# Altium schematic sheet Sheet1.SchDoc: Arduino UNO REV3 Compatible
size A4; ApprovedBy: Leonardo Starling; DrawnBy: Leonardo Starling; Engineer: Leonardo Starling; Organization: STARLING Electronics; Address2: Belo Horizonte, MG; Address3: Brasil; DocumentNumber: 00.00.01; Revision: 00; SheetNumber: 2; SheetTotal: 3
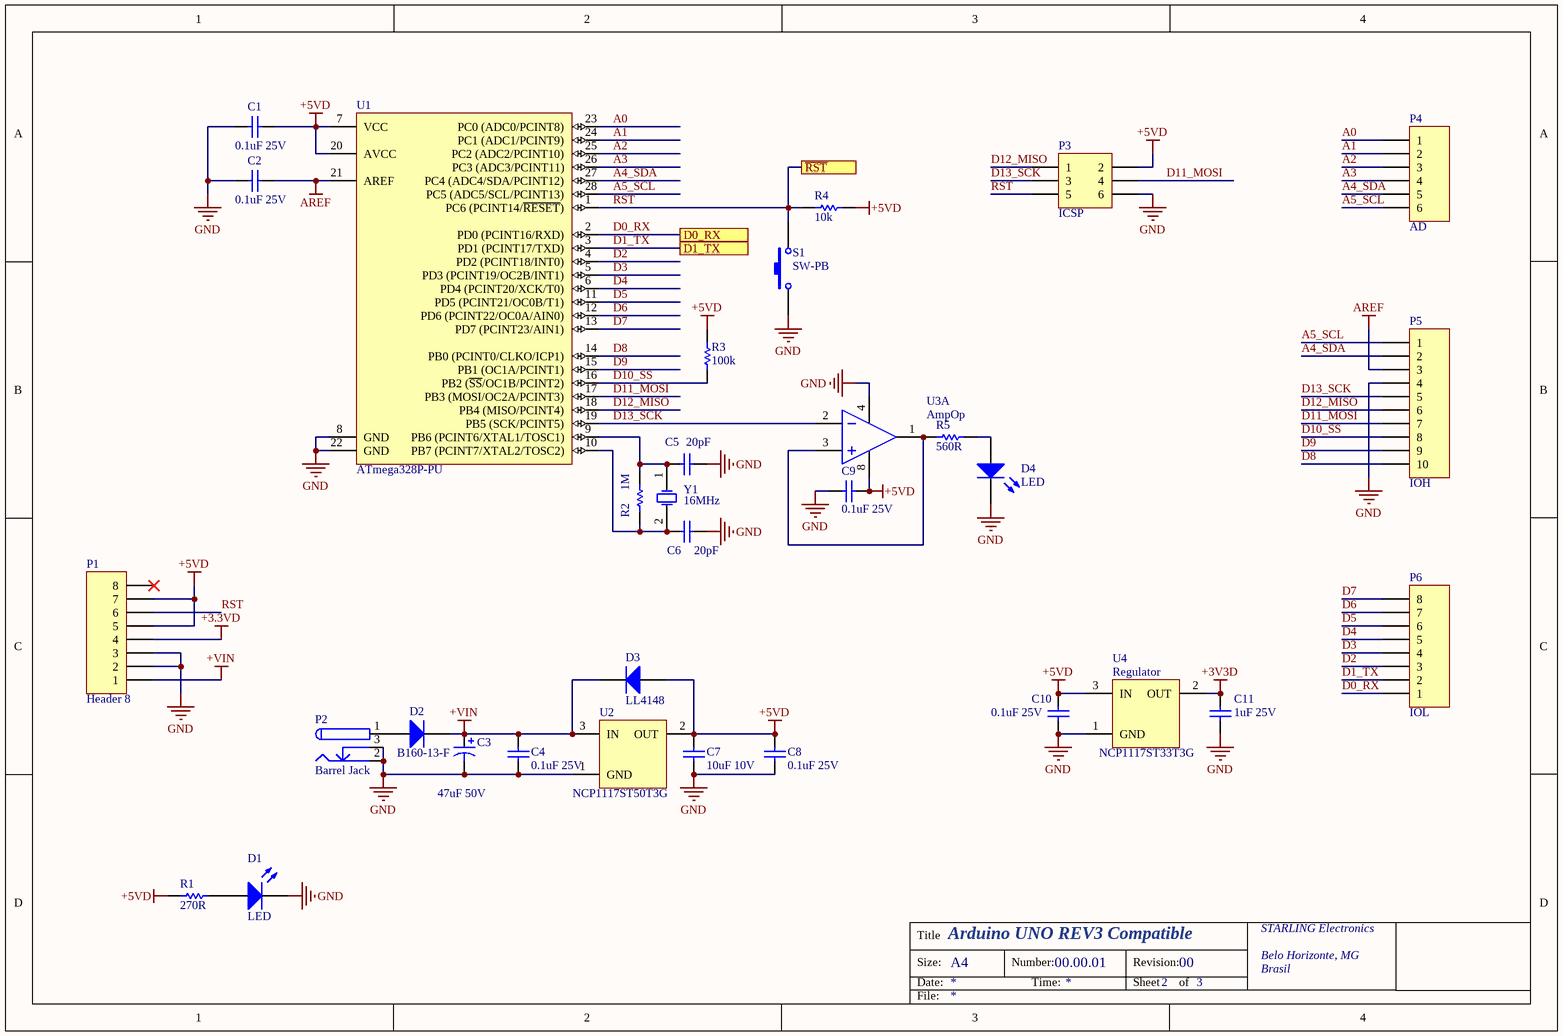
[diagram p0: Sheet1.SchDoc]

## Parts
C1  0.1uF 25V  [C1608[0603]]
C2  0.1uF 25V  [C1608[0603]]
C3  47uF 50V  [Cap_Al_SMD_C6_6.6x6.6mm]
C4  0.1uF 25V  [C1608[0603]]
C5  20pF  [C1608[0603]]
C6  20pF  [C1608[0603]]
C7  10uF 10V  [C2012[0805]]
C8  0.1uF 25V  [C1608[0603]]
C9  0.1uF 25V  [C1608[0603]]
C10  0.1uF 25V  [C1608[0603]]
C11  1uF 25V  [C2012[0805]]
D1  LED  [LED-0603-G]
D2  B160-13-F  [DO214AC]
D3  LL4148  [SOD-80/MLL34]
D4  LED  [LED-0603-R]
P1  Header 8  [HDR1X8F]
P2  Barrel Jack  [BARREL2.5]
P3  ICSP  [HDR2X3M]
P4  AD  [HDR1X6m]
P5  IOH  [HDR1X10]
P6  IOL  [HDR1X8F]
R1  270R  [R1608[0603]]
R2  1M  [R2012[0805]]
R3  100k  [R1608[0603]]
R4  10k  [R1608[0603]]
R5  560R  [R1608[0603]]
S1  SW-PB  [PB-SW-SMT]
U1  ATmega328P-PU  [DIP28]
U2  NCP1117ST50T3G  [SOT223_N]
U3  AmpOp  [TSSOP-8]  (part A of 2)
U4  Regulator  Manufacturer Part Number: NCP1117ST33T3G  [SOT223_N]
Y1  16MHz  [CRYSTAL-HC49/4H_SMX]

## Ports
D0_RX, D1_TX, ~{RST}

## Nets
+3.3VD: P1.4
+3V3D: C11.2 U4.2(OUT)
+5VD: C1.1 C7.2 C8.2 C9.1 C10.2 D3.1(A) P1.5 P1.7 P3.2 R1.1 R3.1 R4.1 U1.7(VCC) U1.20(AVCC) U2.2(OUT) U3.8(V-) U4.3(IN)
+VIN: C3.1 C4.2 D2.2(K) D3.2(K) P1.1 U2.3(IN)
AREF: C2.1 P5.3 U1.21(AREF)
GND: C1.2 C2.2 C3.2 C4.1 C5.2 C6.2 C7.1 C8.1 C9.2 C10.1 C11.1 D1.2(K) D4.2(K) P1.2 P1.3 P2.2 P2.3 P3.6 P5.4 S1.1 U1.8(GND) U1.22(GND) U2.1(GND) U3.4(V+) U4.1(GND)
A0: P4.1 U1.23(PC0_(ADC0/PCINT8))
A1: P4.2 U1.24(PC1_(ADC1/PCINT9))
A2: P4.3 U1.25(PC2_(ADC2/PCINT10))
A3: P4.4 U1.26(PC3_(ADC3/PCINT11))
A4_SDA: P4.5 P5.2 U1.27(PC4_(ADC4/SDA/PCINT12))
A5_SCL: P4.6 P5.1 U1.28(PC5_(ADC5/SCL/PCINT13))
D0_RX: P6.1 U1.2(PD0_(PCINT16/RXD)) ; port D0_RX
D1_TX: P6.2 U1.3(PD1_(PCINT17/TXD)) ; port D1_TX
D2: P6.3 U1.4(PD2_(PCINT18/INT0))
D3: P6.4 U1.5(PD3_(PCINT19/OC2B/INT1))
D4: P6.5 U1.6(PD4_(PCINT20/XCK/T0))
D5: P6.6 U1.11(PD5_(PCINT21/OC0B/T1))
D6: P6.7 U1.12(PD6_(PCINT22/OC0A/AIN0))
D7: P6.8 U1.13(PD7_(PCINT23/AIN1))
D8: P5.10 U1.14(PB0_(PCINT0/CLKO/ICP1))
D9: P5.9 U1.15(PB1_(OC1A/PCINT1))
D10_SS: P5.8 R3.2 U1.16(PB2_(~{SS}/OC1B/PCINT2))
D11_MOSI: P3.4 P5.7 U1.17(PB3_(MOSI/OC2A/PCINT3))
D12_MISO: P3.1 P5.6 U1.18(PB4_(MISO/PCINT4))
D13_SCK: P3.3 P5.5 U1.19(PB5_(SCK/PCINT5)) U3.2(IN-)
~{RST}: P3.5 R4.2 S1.2 U1.1(PC6_(PCINT14/~{RESET})) ; port ~{RST}
RST: P1.6
NetC5_1: C5.1 R2.2 U1.9(PB6_(PCINT6/XTAL1/TOSC1)) Y1.1(OSC1)
NetC6_1: C6.1 R2.1 U1.10(PB7_(PCINT7/XTAL2/TOSC2)) Y1.2(OSC2)
NetD1_1: D1.1(A) R1.2
NetD2_1: D2.1(A) P2.1
NetD4_1: D4.1(A) R5.2
NetR5_1: R5.1 U3.1(OUT) U3.3(IN+)

Not connected (* = marked no-connect by the designer): P1 8*

## Notes on the sheet
- Title
- Size:
- Date:
- A4
- Number:
- Time:
- Revision:
- Sheet
- of
- File:

## Library data of the parts
C1 C2 C9 C10 = C: Capacitor; Manufacturer Part Number: GCM188R71E104KA57D; Value: 1; Capacitance: 100nF; Tolerance: 10%; Dielectric: X7R; Manufacturer: *; PartNumber: *; Package Type: *; Supplier 1: Digi-Key; Supplier Part Number 1: GCM188R71E104KA57D-ND; Stock 1: 0; Mount: Surface Mount; Case/Package: 0603; Case Code (Imperial): 0603; Case Code (Metric): 1608; Min Operating Temperature: -55°C; Max Operating Temperature: 125°C; Packaging: Tape and Reel; Voltage Rating: 25V; Voltage Rating (DC): 25V; Package Quantity: 4000; Termination: SMD/SMT; Voltage: 25V; Length: 1.6mm; Height: 0.8mm; Width: 0.8mm; Thickness: 0.035inch; Depth: 0.8mm; Ratings: AEC-Q200; Radiation Hardening: No; Lead Free: Lead Free
C3 = CP: Polarized Capacitor; Manufacturer Part Number: EEE-1EA470WP; Tolerance: 20%; Ripple Current: 70mA; Voltage Rating: 25V; Life (Hours): 1000Hour; Manufacturer: *; PartNumber: *; Package Type: *; Value: *; Supplier 1: Mouser; Supplier Part Number 1: 667-EEE-1EA470WP; Stock 1: 16748; Pricing 1: 1=0.36, 10=0.173, 50=0.173, 100=0.149, 500=0.112, 1000=0.094, 2000=0.084, 10000=0.077, 25000=0.075, 50000=0.067 (USD); Mount: Surface Mount,PCB; Case/Package: Radial; Contact Plating: Tin; Min Operating Temperature: -40°C; Max Operating Temperature: 85°C; Capacitance: 47uF; Packaging: Tape and Reel; Voltage Rating (DC): 25V; Package Quantity: 1; Termination: SMD/SMT; Ripple Current (AC): 70mA; Diameter: 6.3mm; Length: 5.5mm; Height: 5.4mm; Height - Seated (Max): 0.213inch; Radiation Hardening: No; REACH SVHC: Unknown; Lead Free: Lead Free; ComponentLink1URL: http://www.industrial.panasonic.com/www-data/pdf/ABA0000/ABA0000CE2.pdf?src-supplier=Avnet; ComponentLink1Description: http://www.industrial.panasonic.com/www-data/pdf/ABA0000/ABA0000CE2.pdf?src-supplier=Avnet; ComponentLink2URL: http://www.jameco.com/Jameco/Products/ProdDS/1356009.pdf?src-supplier=Jameco; ComponentLink2Description: http://www.jameco.com/Jameco/Products/ProdDS/1356009.pdf?src-supplier=Jameco; ComponentLink3URL: https://industrial.panasonic.com/cdbs/www-data/pdf/RDE0000/ABA0000C1145.pdf?src-supplier=Future+Electronics; ComponentLink3Description: https://industrial.panasonic.com/cdbs/www-data/pdf/RDE0000/ABA0000C1145.pdf?src-supplier=Future+Electronics; ComponentLink4URL: https://www.alliedelec.com/m/d/310b2cfd0553a89b5ffae819c6e32d0a.pdf?src-supplier=Allied+Electronics; ComponentLink4Description: https://www.alliedelec.com/m/d/310b2cfd0553a89b5ffae819c6e32d0a.pdf?src-supplier=Allied+Electronics; ComponentLink5URL: http://www.mouser.com/ds/2/315/ABA0000CE2-40801.pdf?src-supplier=Mouser; ComponentLink5Description: http://www.mouser.com/ds/2/315/ABA0000CE2-40801.pdf?src-supplier=Mouser; ComponentLink6URL: http://www.industrial.panasonic.com/www-data/pdf/ABA0000/ABA0000CE2.pdf?src-supplier=Avnet+Asia; ComponentLink6Description: http://www.industrial.panasonic.com/www-data/pdf/ABA0000/ABA0000CE2.pdf?src-supplier=Avnet+Asia; ComponentLink7URL: http://www.industrial.panasonic.com/www-data/pdf/ABA0000/ABA0000CE2.pdf?src-supplier=Avnet+Europe; ComponentLink7Description: http://www.industrial.panasonic.com/www-data/pdf/ABA0000/ABA0000CE2.pdf?src-supplier=Avnet+Europe; ComponentLink8URL: https://www.verical.com/server-webapp/html/getDatasheet?partID=135372&src-supplier=Verical; ComponentLink8Description: https://www.verical.com/server-webapp/html/getDatasheet?partID=135372&src-supplier=Verical
C4 = C: Capacitor; Manufacturer Part Number: C0603C104Z3VACTU; Value: 1; Dielectric Material: Ceramic; Capacitance: 100nF; Tolerance: 80%; Dielectric: Y5V; Dissipation Factor: 7%; Manufacturer: *; PartNumber: *; Package Type: *; Supplier 1: Digi-Key; Supplier Part Number 1: 399-1100-6-ND; Stock 1: 1624830; Pricing 1: 1=0.1, 10=0.035, 100=0.0156, 500=0.01114, 1000=0.00875 (USD); Mount: Surface Mount,PCB; Case/Package: 0603; Number of Pins: 2; Case Code (Metric): 1608; Case Code (Imperial): 0603; Min Operating Temperature: -30°C; Max Operating Temperature: 85°C; Packaging: Tape and Reel; Voltage Rating: 25V; Voltage Rating (DC): 25V; Package Quantity: 1; Termination: SMD/SMT; Voltage: 25V; Length: 1.6mm; Height: 0.8mm; Width: 0.031inch; Thickness: 0.034inch; Depth: 0.8mm; Lead Pitch: 0.7mm; Radiation Hardening: No; REACH SVHC: No SVHC; Lead Free: Lead Free; ComponentLink1URL: http://www.farnell.com/datasheets/1470417.pdf?src-supplier=Element14; ComponentLink1Description: http://www.farnell.com/datasheets/1470417.pdf?src-supplier=Element14; ComponentLink2URL: http://www.farnell.com/datasheets/1828802.pdf?src-supplier=Element14; ComponentLink2Description: http://www.farnell.com/datasheets/1828802.pdf?src-supplier=Element14; ComponentLink3URL: http://www.alliedelec.com/m/d/9bfe7773041ffe9d406e68bc7b377fdd.pdf?src-supplier=Allied+Electronics; ComponentLink3Description: http://www.alliedelec.com/m/d/9bfe7773041ffe9d406e68bc7b377fdd.pdf?src-supplier=Allied+Electronics
C5 C6 = C: Capacitor; Manufacturer Part Number: CL10C200JB8NNNC; Value: 1; Tolerance: 5%; Dielectric: C0G; Voltage Rating: 50V; Temperature Coefficient: 300ppm/°C; Manufacturer: *; PartNumber: *; Package Type: *; Supplier 1: Digi-Key; Supplier Part Number 1: 1276-1187-6-ND; Stock 1: 40000; Pricing 1: 1=0.1, 10=0.048, 100=0.0214, 500=0.01532, 1000=0.01203 (USD); Mount: Surface Mount; Case/Package: 0603; Case Code (Metric): 1608; Case Code (Imperial): 0603; Min Operating Temperature: -55°C; Max Operating Temperature: 125°C; Capacitance: 20pF; Package Quantity: 1; Packaging: Tape and Reel; Voltage: 50V; Length: 1.6mm; Height: 0.8mm; Width: 0.031inch; Thickness: 0.035inch; Depth: 0.8mm; Radiation Hardening: No
C7 = C: Capacitor; Manufacturer Part Number: C2012X7R1A106K125AC; Value: 1; Dielectric Material: Ceramic; Tolerance: 10%; Dielectric: X7R; Manufacturer: *; PartNumber: *; Package Type: *; Supplier 1: Digi-Key; Supplier Part Number 1: 445-6857-6-ND; Stock 1: 760363; Pricing 1: 1=0.5, 10=0.345, 100=0.207, 500=0.15526, 1000=0.1311 (USD); Mount: Surface Mount; Case/Package: 0805; Number of Pins: 2; Weight: 0.000194oz; Case Code (Metric): 2012; Case Code (Imperial): 0805; Contact Plating: Tin,Matte; Min Operating Temperature: -55°C; Max Operating Temperature: 125°C; Capacitance: 10uF; Voltage Rating: 10V; Packaging: Tape and Reel; Package Quantity: 1; Voltage Rating (DC): 10V; Termination: SMD/SMT; Voltage: 10V; Composition: Ceramic; Length: 2mm; Height: 1.25mm; Width: 0.049inch; Thickness: 0.057inch; Depth: 1.25mm; Radiation Hardening: No; REACH SVHC: No SVHC; Lead Free: Lead Free; ComponentLink1URL: http://www.farnell.com/datasheets/2792994.pdf?src-supplier=Newark; ComponentLink1Description: http://www.farnell.com/datasheets/2792994.pdf?src-supplier=Newark; ComponentLink2URL: http://www.farnell.com/datasheets/2792994.pdf?src-supplier=Element14; ComponentLink2Description: http://www.farnell.com/datasheets/2792994.pdf?src-supplier=Element14; ComponentLink3URL: http://product.tdk.com/capacitor/mlcc/en/documents/mlcc_commercial_general_en.pdf?src-supplier=Element14; ComponentLink3Description: http://product.tdk.com/capacitor/mlcc/en/documents/mlcc_commercial_general_en.pdf?src-supplier=Element14; ComponentLink4URL: https://product.tdk.com/info/en/catalog/spec/mlccspec_commercial_general_midvoltage_en.pdf?src-supplier=Digi-Key; ComponentLink4Description: https://product.tdk.com/info/en/catalog/spec/mlccspec_commercial_general_midvoltage_en.pdf?src-supplier=Digi-Key; ComponentLink5URL: http://www.tdk.co.jp/tefe02/e412_c.pdf?src-supplier=Avnet+Europe; ComponentLink5Description: http://www.tdk.co.jp/tefe02/e412_c.pdf?src-supplier=Avnet+Europe; ComponentLink6URL: http://www.farnell.com/datasheets/1796654.pdf?src-supplier=Element14; ComponentLink6Description: http://www.farnell.com/datasheets/1796654.pdf?src-supplier=Element14; ComponentLink7URL: http://www.mouser.com/ds/2/400/lcc_commercial_general_en-837201.pdf?src-supplier=Mouser; ComponentLink7Description: http://www.mouser.com/ds/2/400/lcc_commercial_general_en-837201.pdf?src-supplier=Mouser; ComponentLink8URL: http://www.farnell.com/datasheets/1744655.pdf?src-supplier=Element14; ComponentLink8Description: http://www.farnell.com/datasheets/1744655.pdf?src-supplier=Element14
C8 = C: Capacitor; Value: 1; Manufacturer: *; PartNumber: *; Package Type: *
C11 = C: Capacitor; Manufacturer: TDK; Manufacturer Part Number: C2012X7R1E105K125AB; Dielectric Material: Ceramic; Tolerance: 10%; Dielectric: X7R; Supplier 1: Digi-Key; Supplier Part Number 1: 445-1354-1-ND; Stock 1: 0; Pricing 1: 1=0.16, 10=0.115, 100=0.054, 500=0.0379, 1000=0.03137 (USD); Mount: Surface Mount; Case/Package: 0805; Number of Pins: 2; Weight: 0.000194oz; Case Code (Imperial): 0805; Case Code (Metric): 2012; Min Operating Temperature: -55°C; Max Operating Temperature: 125°C; Voltage Rating: 25V; Packaging: Tape and Reel; Capacitance: 1uF; Voltage Rating (DC): 25V; Package Quantity: 1; Termination: SMD/SMT; Voltage: 25V; Composition: Ceramic; Length: 2mm; Height: 1.25mm; Width: 1.25mm; Thickness: 0.057inch; Depth: 1.25mm; Radiation Hardening: No; Lead Free: Lead Free; REACH SVHC: No SVHC
D1 = LED: Manufacturer Part Number: 598-8070-102F; Color: Green; Lens Color: Colorless,Clear; Forward Current: 25mA; Forward Voltage: 2V; Power Rating: 60mW; Luminous Intensity: 20mcd; Viewing Angle: 140°; Lens Style: Flat,Clear,Diffused,Colorless,Rectangular; Wavelength: 570nm; Lens Transparency: Clear; Test Current: 20mA; Dominant Wavelength: 568nm; Number of LEDs: 1; Reverse Voltage: 5V; Lens Size: 0.8mm; Manufacturer: *; PartNumber: *; Package Type: *; Supplier 1: Digi-Key; Supplier Part Number 1: 350-3660-ND; Stock 1: 5777; Pricing 1: 1=0.53, 10=0.414, 100=0.2651, 500=0.228, 1000=0.17604, 2500=0.15908, 5000=0.14847, 10000=0.14317, 25000=0.14105 (USD); Mount: Surface Mount; Case/Package: 0603; Number of Pins: 2; Case Code (Metric): 1608; Case Code (Imperial): 0603; Min Operating Temperature: -30°C; Max Operating Temperature: 85°C; Illumination Color: Green; Packaging: Cut Tape; Package Quantity: 20; Length: 1.6mm; Height: 0.7mm; Width: 0.8mm; REACH SVHC: No SVHC; ComponentLink1URL: http://www.onlinecomponents.com/productFiles/mf-DIA/mdei5980603_a-w.pdf?src-supplier=Onlinecomponents.com; ComponentLink1Description: http://www.onlinecomponents.com/productFiles/mf-DIA/mdei5980603_a-w.pdf?src-supplier=Onlinecomponents.com; ComponentLink2URL: https://www.alliedelec.com/m/d/ce482e3e914816937d955afcf4cefdeb.pdf?src-supplier=Allied+Electronics; ComponentLink2Description: https://www.alliedelec.com/m/d/ce482e3e914816937d955afcf4cefdeb.pdf?src-supplier=Allied+Electronics; ComponentLink3URL: http://www.farnell.com/datasheets/25658.pdf?src-supplier=Farnell; ComponentLink3Description: http://www.farnell.com/datasheets/25658.pdf?src-supplier=Farnell; ComponentLink4URL: http://datasheet.octopart.com/5988070102F-Dialight-datasheet-148086.pdf?src-supplier=Newark; ComponentLink4Description: http://datasheet.octopart.com/5988070102F-Dialight-datasheet-148086.pdf?src-supplier=Newark; ComponentLink5URL: http://datasheet.octopart.com/5988070102F-Dialight-datasheet-9877213.pdf?src-supplier=Newark; ComponentLink5Description: http://datasheet.octopart.com/5988070102F-Dialight-datasheet-9877213.pdf?src-supplier=Newark; ComponentLink6URL: http://datasheet.octopart.com/598-8070-102F-Dialight-datasheet-9702989.pdf?src-supplier=Allied+Electronics; ComponentLink6Description: http://datasheet.octopart.com/598-8070-102F-Dialight-datasheet-9702989.pdf?src-supplier=Allied+Electronics; ComponentLink7URL: http://datasheet.octopart.com/598-8070-102F-Dialight-datasheet-27847156.pdf?src-supplier=Electro+Sonic; ComponentLink7Description: http://datasheet.octopart.com/598-8070-102F-Dialight-datasheet-27847156.pdf?src-supplier=Electro+Sonic
D2 = D: Diode; Peak Reverse Current: 500uA; Forward Current: 1A; Max Repetitive Reverse Voltage (Vrrm): 60V; Peak Non-Repetitive Surge Current: 30A; Element Configuration: Single; Forward Voltage: 700mV; Polarity: Standard; Capacitance: 110pF; Manufacturer: *; PartNumber: *; Package Type: *; Supplier 1: Mouser; Supplier Part Number 1: 621-B160-F; Manufacturer Part Number: B160-13-F; Stock 1: 99892; Pricing 1: 1=0.34, 10=0.225, 50=0.225, 100=0.094, 1000=0.064, 5000=0.05, 10000=0.043, 25000=0.04, 50000=0.038 (USD); Mount: Surface Mount; Case/Package: SMA; Number of Pins: 2; Weight: 0.002258oz; Contact Plating: Tin,Matte; Min Operating Temperature: -65°C; Max Operating Temperature: 150°C; Package Quantity: 5000; Packaging: Tape and Reel; Average Rectified Current: 1A; Max Forward Surge Current (Ifsm): 30A; Termination: SMD/SMT; Voltage Rating (DC): 60V; Current Rating: 1A; Output Current: 1A; Max Reverse Voltage (DC): 60V; Length: 4.6mm; Height: 2.1mm; Width: 2.92mm; Radiation Hardening: No; REACH SVHC: No SVHC; Lead Free: Lead Free; ComponentLink1URL: https://www.diodes.com/assets/Datasheets/ds13002.pdf?src-supplier=Digi-Key; ComponentLink1Description: https://www.diodes.com/assets/Datasheets/ds13002.pdf?src-supplier=Digi-Key; ComponentLink2URL: http://www.farnell.com/datasheets/1911815.pdf?src-supplier=Element14; ComponentLink2Description: http://www.farnell.com/datasheets/1911815.pdf?src-supplier=Element14; ComponentLink3URL: http://www.diodes.com/datasheets/ds13002.pdf?src-supplier=Future+Electronics; ComponentLink3Description: http://www.diodes.com/datasheets/ds13002.pdf?src-supplier=Future+Electronics; ComponentLink4URL: http://www.diodes.com///datasheets/ds13002.pdf?src-supplier=Avnet+Europe; ComponentLink4Description: http://www.diodes.com///datasheets/ds13002.pdf?src-supplier=Avnet+Europe; ComponentLink5URL: http://www.diodes.com///datasheets/ds13002.pdf?src-supplier=Avnet; ComponentLink5Description: http://www.diodes.com///datasheets/ds13002.pdf?src-supplier=Avnet
D3 = D: Diode; Forward Voltage: 1V; Peak Non-Repetitive Surge Current: 2A; Element Configuration: Single; Forward Current: 200mA; Recovery Time: 4ns; Max Repetitive Reverse Voltage (Vrrm): 100V; Power Dissipation: 500mW; Peak Reverse Current: 25nA; Manufacturer: *; PartNumber: *; Package Type: *; Supplier 1: Mouser; Supplier Part Number 1: 512-LL4148; Manufacturer Part Number: LL4148; Stock 1: 512865; Pricing 1: 1=0.1, 10=0.087, 50=0.087, 100=0.031, 1000=0.021, 2500=0.016, 10000=0.014, 25000=0.013, 50000=0.011 (USD); Mount: Surface Mount; Number of Pins: 2; Weight: 0.01lb; Contact Plating: Tin,Matte; Min Operating Temperature: -65°C; Max Operating Temperature: 175°C; Packaging: Tape and Reel; Max Surge Current: 2A; Package Quantity: 2500; Average Rectified Current: 200mA; Reverse Recovery Time: 4ns; Max Reverse Voltage (DC): 100V; Max Forward Surge Current (Ifsm): 2A; Voltage: 100V; Reverse Voltage: 100V; Length: 3.6mm; Height: 1.5mm; Width: 1.5mm; Radiation Hardening: No; Lead Free: Lead Free; REACH SVHC: No SVHC; ComponentLink1URL: http://www.farnell.com/datasheets/2150156.pdf?src-supplier=Element14; ComponentLink1Description: http://www.farnell.com/datasheets/2150156.pdf?src-supplier=Element14; ComponentLink2URL: https://www.fairchildsemi.com/datasheets/LL/LL4148.pdf?src-supplier=Avnet; ComponentLink2Description: https://www.fairchildsemi.com/datasheets/LL/LL4148.pdf?src-supplier=Avnet; ComponentLink3URL: https://www.fairchildsemi.com/datasheets/LL/LL4148.pdf?src-supplier=Digi-Key; ComponentLink3Description: https://www.fairchildsemi.com/datasheets/LL/LL4148.pdf?src-supplier=Digi-Key; ComponentLink4URL: http://www.jameco.com/Jameco/Products/ProdDS/94908.pdf?src-supplier=Jameco; ComponentLink4Description: http://www.jameco.com/Jameco/Products/ProdDS/94908.pdf?src-supplier=Jameco; ComponentLink5URL: http://www.mouser.com/ds/2/149/LL4148-70504.pdf?src-supplier=Mouser; ComponentLink5Description: http://www.mouser.com/ds/2/149/LL4148-70504.pdf?src-supplier=Mouser; ComponentLink6URL: http://www.farnell.com/datasheets/2037793.pdf?src-supplier=Element14; ComponentLink6Description: http://www.farnell.com/datasheets/2037793.pdf?src-supplier=Element14; ComponentLink7URL: https://www.verical.com/server-webapp/html/getDatasheet?partID=110057&src-supplier=Verical; ComponentLink7Description: https://www.verical.com/server-webapp/html/getDatasheet?partID=110057&src-supplier=Verical; ComponentLink8URL: http://www.farnell.com/datasheets/1896420.pdf?src-supplier=Element14; ComponentLink8Description: http://www.farnell.com/datasheets/1896420.pdf?src-supplier=Element14
D4 = LED: Manufacturer Part Number: LTST-C191KRKT; Colour: Red; Lens Colour: Colorless; Power Rating: 75mW; Luminous Intensity: 54mcd; Viewing Angle: 130°; Forward Voltage: 2V; Lens Style: Clear,Colorless,Diffused,Rectangular; Forward Current: 30mA; Dominant Wavelength: 631nm; Test Current: 20mA; Lens Transparency: Clear; Number of Elements: 1; Wavelength: 639nm; Reverse Voltage: 5V; Current: 2A; Manufacturer: *; PartNumber: *; Package Type: *; Supplier 1: Digi-Key; Supplier Part Number 1: 160-1447-6-ND; Stock 1: 978989; Pricing 1: 1=0.29, 10=0.211, 25=0.1556, 100=0.1111, 250=0.07556, 500=0.06666, 1000=0.05222, 2500=0.05111 (USD); Mount: Surface Mount; Case/Package: 0603; Number of Pins: 2; Case Code (Metric): 1608; Case Code (Imperial): 0603; Min Operating Temperature: -55°C; Max Operating Temperature: 85°C; Packaging: Tape and Reel; Package Quantity: 1; Illumination Colour: Red; Power Dissipation: 75mW; Number of LEDs: 1; Voltage: 2V; Length: 1.6mm; Height: 0.55mm; Width: 0.8mm; Depth: 0.8mm; Radiation Hardening: No; Lead Free: Lead Free
P1 = Header 8: Header, 8-Pin; LatestRevisionDate: 17-Jul-2002; LatestRevisionNote: Re-released for DXP Platform.; Publisher: Altium Limited
P2 = PWR2.5: Low Voltage Power Supply Connector; Manufacturer: Memory Protection Devices; Manufacturer Part Number: EJ503A; Pricing 1: 1=2.7, 10=2.447, 100=2.0977, 500=1.74806, 1000=1.49834 (USD); Stock 1: 1084; Supplier 1: Digi-Key; Supplier Part Number 1: EJ503A-ND
P3 = Header 3X2: Header, 3-Pin, Dual row; Manufacturer: Harwin; Manufacturer Part Number: M20-9720345; Max Current Rating: 3A; Contact Resistance: 25mR; Number of Positions: 6; Gender: Male; Connector Type: Male Pin; Pitch: 2.54mm; Row Spacing: 0.1inch; LatestRevisionDate: 17-Jul-2002; LatestRevisionNote: Re-released for DXP Platform.; Publisher: Altium Limited; Supplier 1: Digi-Key; Supplier Part Number 1: 952-1921-ND; Stock 1: 4637; Pricing 1: 1=0.33, 10=0.308, 100=0.2156, 500=0.1848, 1000=0.154, 5000=0.132, 10000=0.1232 (USD); Mount: Through Hole; Contact Plating: Gold; Colour: Black; Contact Material: Brass; Housing Colour: Black; Housing Material: Nylon; Min Operating Temperature: -40°C; Max Operating Temperature: 105°C; Package Quantity: 1000; Packaging: Bulk; Termination: Solder; Number of Rows: 2; Number of Contacts: 6; Orientation: Straight; Length: 7.62mm; Depth: 5.08mm; Contact Mating Length: 0.276inch; Radiation Hardening: No
P4 = Header 6: Header, 6-Pin; LatestRevisionDate: 17-Jul-2002; LatestRevisionNote: Re-released for DXP Platform.; Publisher: Altium Limited
P5 = Header 10
P6 = Header 8: Header, 8-Pin; Manufacturer: Sullins; Manufacturer Part Number: PPTC081LFBN-RC; Number of Positions: 8; Connector Type: Header,Socket; Pitch: 0.1inch; LatestRevisionDate: 17-Jul-2002; LatestRevisionNote: Re-released for DXP Platform.; Publisher: Altium Limited; Supplier 1: Digi-Key; Supplier Part Number 1: S7006-ND; Stock 1: 21933; Pricing 1: 1=0.65, 10=0.608, 400=0.42525, 800=0.3645, 1200=0.33413, 5200=0.29363, 10000=0.2925 (USD); Mount: Through Hole; Colour: Black; Contact Plating: Tin; Contact Material: Bronze; Housing Material: Plastic; Package Quantity: 1000; Number of Rows: 1; Packaging: Bulk; Termination: Solder; Length: 20.8mm; Height: 8.5mm; Width: 2.5mm; Lead Free: Lead Free
R1 = R: Resistor; Manufacturer Part Number: CRCW0603-0000Z0EA; Value: 0; Power Rating: 100mW; Resistance: 0mR; Voltage Rating: 75V; Tolerance: 5%; Temperature Coefficient: 100ppm/°C; Current Rating: 2A; Manufacturer: *; PartNumber: *; Package Type: *; Supplier 1: Digi-Key; Supplier Part Number 1: 541-0.0GCT-ND; Stock 1: 959944; Pricing 1: 1=0.1, 10=0.034, 25=0.0244, 50=0.0186, 100=0.0138, 250=0.01048, 500=0.0084, 1000=0.00618 (USD); Mount: Surface Mount; Case/Package: 0603; Weight: 7.1E-05oz; Case Code (Metric): 1608; Case Code (Imperial): 0603; Contact Plating: Tin,Lead; Min Operating Temperature: -55°C; Max Operating Temperature: 155°C; Packaging: Tape and Reel; Package Quantity: 1; Composition: Thick Film; Number of Terminations: 2; Termination: SMD/SMT; Military Standard: Not; Max Power Dissipation: 100mW; Voltage Rating (DC): 75V; Features: Automotive AEC-Q200; Working Voltage: 75V; Length: 1.55mm; Height: 0.02inch; Width: 0.033inch; Depth: 0.85mm; Radiation Hardening: No; Lead Free: Lead Free; REACH SVHC: Unknown; ComponentLink1URL: http://www.vishay.com/docs/20035/dcrcwe3.pdf?src-supplier=Digi-Key; ComponentLink1Description: http://www.vishay.com/docs/20035/dcrcwe3.pdf?src-supplier=Digi-Key; ComponentLink2URL: http://www.farnell.com/datasheets/2310790.pdf?src-supplier=Avnet; ComponentLink2Description: http://www.farnell.com/datasheets/2310790.pdf?src-supplier=Avnet; ComponentLink3URL: http://www.vishay.com/docs/20008/dcrcw.pdf?src-supplier=Avnet+Europe; ComponentLink3Description: http://www.vishay.com/docs/20008/dcrcw.pdf?src-supplier=Avnet+Europe; ComponentLink4URL: http://www.vishay.com/docs/20035/dcrcwe3.pdf?src-supplier=Future+Electronics; ComponentLink4Description: http://www.vishay.com/docs/20035/dcrcwe3.pdf?src-supplier=Future+Electronics; ComponentLink5URL: http://www.alliedelec.com/m/d/0c934d6939ccefa68dbe0b96d821c8cf.pdf?src-supplier=Allied+Electronics; ComponentLink5Description: http://www.alliedelec.com/m/d/0c934d6939ccefa68dbe0b96d821c8cf.pdf?src-supplier=Allied+Electronics; ComponentLink6URL: https://www.distrelec.biz/Web/Downloads/a_/en/flD-CRCW-e3_data_en.pdf?mime=application%2Fpdf&src-supplier=Distrelec; ComponentLink6Description: https://www.distrelec.biz/Web/Downloads/a_/en/flD-CRCW-e3_data_en.pdf?mime=application%2Fpdf&src-supplier=Distrelec; ComponentLink7URL: http://www.farnell.com/datasheets/2310790.pdf?src-supplier=Mouser; ComponentLink7Description: http://www.farnell.com/datasheets/2310790.pdf?src-supplier=Mouser; ComponentLink8URL: http://www.farnell.com/datasheets/2111203.pdf?src-supplier=Element14; ComponentLink8Description: http://www.farnell.com/datasheets/2111203.pdf?src-supplier=Element14; ComponentLink9URL: http://www.farnell.com/datasheets/125364.pdf?src-supplier=Element14; ComponentLink9Description: http://www.farnell.com/datasheets/125364.pdf?src-supplier=Element14
R2 = R: Resistor; Manufacturer Part Number: ERA-6AEB105V; Value: 0; Resistance: 1MR; Tolerance: 1%; Temperature Coefficient: 25ppm/°C; Voltage Rating: 100V; Power Rating: 125mW; Manufacturer: *; PartNumber: *; Package Type: *; Supplier 1: Digi-Key; Supplier Part Number 1: P1MDADKR-ND; Stock 1: 150805; Pricing 1: 1=0.36, 10=0.302, 100=0.1182, 1000=0.04948, 2500=0.04536 (USD); Mount: Surface Mount; Case/Package: 0805; Number of Pins: 2; Contact Plating: Tin; Case Code (Imperial): 0805; Case Code (Metric): 2012; Min Operating Temperature: -55°C; Max Operating Temperature: 155°C; Composition: Thin Film; Packaging: Tape and Reel; Package Quantity: 1; Number of Terminations: 2; Military Standard: Not; Termination: Solder; Max Power Dissipation: 125mW; Voltage Rating (DC): 100V; Working Voltage: 100V; Features: Automotive AEC-Q200; Length: 2mm; Height: 0.5mm; Width: 1.25mm; Depth: 1.25mm; Radiation Hardening: No; REACH SVHC: No SVHC; Lead Free: Lead Free
R3 = R: Resistor; Manufacturer Part Number: MCT06030C1003FP500; Value: 0; Resistance: 100kR; Tolerance: 1%; Temperature Coefficient: 50ppm/°C; Power Rating: 100mW; Voltage Rating: 75V; Max Power Dissipation: 125mW; Manufacturer: *; PartNumber: *; Package Type: *; Supplier 1: Digi-Key; Supplier Part Number 1: MCT0603-100K-CFDKR-ND; Stock 1: 0; Pricing 1: 1=0.18, 10=0.152, 100=0.0596, 1000=0.02495, 2500=0.02287 (USD); Mount: Surface Mount; Case/Package: 0603; Weight: 7.1E-05oz; Case Code (Metric): 1608; Case Code (Imperial): 0603; Contact Plating: Tin; Min Operating Temperature: -55°C; Max Operating Temperature: 125°C; Packaging: Tape and Reel; Composition: Thin Film; Voltage Rating (DC): 75V; Military Standard: Not; Package Quantity: 1; Number of Terminations: 2; Termination: SMD/SMT; Length: 1.55mm; Height: 0.022inch; Depth: 0.85mm; Width: 0.033inch; Radiation Hardening: No; REACH SVHC: Unknown; Lead Free: Lead Free
R4 = R: Resistor; Manufacturer Part Number: MCT06030C1002FP500; Value: 0; Resistance: 10kR; Power Rating: 100mW; Tolerance: 1%; Max Power Dissipation: 125mW; Voltage Rating: 75V; Temperature Coefficient: 50ppm/°C; Manufacturer: *; PartNumber: *; Package Type: *; Supplier 1: Digi-Key; Supplier Part Number 1: MCT0603-10.0K-CFDKR-ND; Stock 1: 1373195; Pricing 1: 1=0.18, 10=0.152, 100=0.0596, 1000=0.02495, 2500=0.02287 (USD); Mount: Surface Mount; Case/Package: 0603; Case Code (Imperial): 0603; Case Code (Metric): 1608; Contact Plating: Tin; Min Operating Temperature: -55°C; Max Operating Temperature: 125°C; Packaging: Tape and Reel; Package Quantity: 1; Composition: Thin Film; Military Standard: Not; Voltage Rating (DC): 75V; Number of Terminations: 2; Length: 1.55mm; Height: 0.022inch; Depth: 0.85mm; Width: 0.8mm; Radiation Hardening: No; REACH SVHC: Unknown; Lead Free: Lead Free
R5 = R: Resistor; Manufacturer Part Number: AC0603FR-07560RL; Value: 0; Tolerance: 1%; Voltage Rating: 50V; Power Rating: 100mW; Temperature Coefficient: 100ppm/°C; Manufacturer: *; PartNumber: *; Package Type: *; Supplier 1: Digi-Key; Supplier Part Number 1: YAG3618DKR-ND; Stock 1: 31951; Pricing 1: 1=0.1, 10=0.032, 100=0.0129, 1000=0.00579, 2500=0.00502 (USD); Case/Package: 0603; Weight: 7.1E-05oz; Case Code (Imperial): 0603; Case Code (Metric): 1608; Min Operating Temperature: -55°C; Max Operating Temperature: 155°C; Resistance: 560R; Packaging: Tape and Reel; Composition: Thick Film; Termination: SMD/SMT; Number of Terminations: 2; Max Power Dissipation: 100mW; Features: Automotive AEC-Q200,Moisture Resistant; Length: 0.063inch; Height: 0.022inch; Width: 0.8mm; Lead Free: Lead Free
S1 = SW Tact: Tactile Switch; Manufacturer Part Number: PTS645SM43SMTR92LFS; Mechanical Life: 100000Cycles; Actuator Material: Nylon,Polyamide; Max Voltage Rating (DC): 12V; Throw Configuration: SPST; Contact Resistance: 100mR; Operating Force: 160gf; Max Current Rating: 50mA; Illumination Type: Illuminated,Non-Illuminated; Switch Function: Off-Mom; Actuator Type: Standard; Actuator Length: 0.85mm; Manufacturer: *; PartNumber: *; Package Type: *; Supplier 1: Digi-Key; Supplier Part Number 1: CKN9112DKR-ND; Stock 1: 477790; Pricing 1: 1=0.16, 10=0.157, 25=0.1516, 50=0.1462, 100=0.1381, 250=0.12996, 500=0.12452 (USD); Mount: Surface Mount; Case/Package: SMD/SMT; Contact Plating: Silver; Contact Material: Silver; Colour: Black; Min Operating Temperature: -20°C; Max Operating Temperature: 60°C; Packaging: Tape and Reel; Package Quantity: 1000; Current Rating: 50mA; Voltage Rating (DC): 12V; Termination: Gull Wing; Orientation: Straight; Length: 6mm; Depth: 9mm; REACH SVHC: No SVHC; Lead Free: Lead Free
U1 = ATmega328P-PU: 8-bit AVR Microcontroller, 32KB Flash, 1KB EEPROM, 2KB SRAM, 28-pin PDIP, Industrial Grade (-40°C to 85°C); DatasheetVersion: revD, May-2011; PackageVersion: revB, Sep-2001; PackageReference: 28P3; PackageDescription: 28-lead (0.300"/7.62mm Wide) Plastic Dual Inline Package (PDIP); ComponentLink1Description: Manufacturer URL; ComponentLink1URL: http://www.atmel.com/; ComponentLink2Description: ATmega48A/48PA/88A/88PA/168A/168PA/328/328P Datasheet; ComponentLink2URL: http://www.atmel.com/dyn/resources/prod_documents/8271.pdf; ComponentLink3Description: ATmega48A/48PA/88A/88PA/168A/168PA/328/328P Summary; ComponentLink3URL: http://www.atmel.com/dyn/resources/prod_documents/8271S.pdf
U2 = Regulator: Output Voltage: 5V; Number of Outputs: 1; Max Input Voltage: 20V; Output Current: 1A; Min Input Voltage: 3.5V; Dropout Voltage: 1.2V; Input Bias Current: 6mA; Polarity: Positive; Quiescent Current: 10mA; Output Voltage Accuracy: 1%; Power Rating: 781mW; Output Type: Fixed; Manufacturer: *; Package Type: *; PartNumber: *; Supplier 1: Mouser; Supplier Part Number 1: 863-NCP1117ST50T3G; Manufacturer Part Number: NCP1117ST50T3G; Stock 1: 11535; Pricing 1: 1=0.47, 10=0.39, 50=0.39, 100=0.238, 1000=0.184, 4000=0.157, 8000=0.146, 10000=0.146, 24000=0.139, 48000=0.135, 100000=0.13 (USD); Case/Package: SOT-223; Number of Pins: 4; Contact Plating: Tin,Matte; Min Operating Temperature: 0°C; Max Operating Temperature: 125°C; Package Quantity: 1; Max Output Current: 1A; Nominal Output Voltage: 5V; Packaging: Tape and Reel; Number of Regulators: 1; Min Current Limit: 1A; Accuracy: 1%; Tolerance: 1%; Length: 6.7mm; Height: 1.69mm; Width: 3.7mm; Radiation Hardening: No; REACH SVHC: No SVHC; Lead Free: Lead Free; Halogen Free: Halogen Free; ComponentLink1URL: http://www.onsemi.com/pub/Collateral/NCP1117-D.PDF?src-supplier=Digi-Key; ComponentLink1Description: http://www.onsemi.com/pub/Collateral/NCP1117-D.PDF?src-supplier=Digi-Key; ComponentLink2URL: http://www.onsemi.ru.com/pub/Collateral/NCP1117-D.PDF?src-supplier=Avnet+Europe; ComponentLink2Description: http://www.onsemi.ru.com/pub/Collateral/NCP1117-D.PDF?src-supplier=Avnet+Europe; ComponentLink3URL: http://www.onsemi.ru.com/pub/Collateral/NCP1117-D.PDF?src-supplier=Avnet+Asia; ComponentLink3Description: http://www.onsemi.ru.com/pub/Collateral/NCP1117-D.PDF?src-supplier=Avnet+Asia; ComponentLink4URL: http://www.onsemi.com/pub/Collateral/NCP1117-D.PDF?src-supplier=Element14; ComponentLink4Description: http://www.onsemi.com/pub/Collateral/NCP1117-D.PDF?src-supplier=Element14; ComponentLink5URL: http://www.farnell.com/datasheets/1748260.pdf?src-supplier=Element14; ComponentLink5Description: http://www.farnell.com/datasheets/1748260.pdf?src-supplier=Element14; ComponentLink6URL: http://www.onsemi.ru.com/pub/Collateral/NCP1117-D.PDF?src-supplier=Avnet; ComponentLink6Description: http://www.onsemi.ru.com/pub/Collateral/NCP1117-D.PDF?src-supplier=Avnet; ComponentLink7URL: http://www.onsemi.com/pub_link/Collateral/NCP1117-D.PDF?src-supplier=Future+Electronics; ComponentLink7Description: http://www.onsemi.com/pub_link/Collateral/NCP1117-D.PDF?src-supplier=Future+Electronics; ComponentLink8URL: http://www.farnell.com/datasheets/1878391.pdf?src-supplier=Element14; ComponentLink8Description: http://www.farnell.com/datasheets/1878391.pdf?src-supplier=Element14
U3 = LM358PWR: Manufacturer: Texas Instruments; Number of Channels: 2; Gain Bandwidth Product: 700kHz; Slew Rate: 0.3V/µs; Output Current: 30mA; Nominal Supply Current: 1.2mA; Input Bias Current: 250nA; Input Offset Voltage (Vos): 7mV; Operating Supply Current: 1mA; Min Supply Voltage: 3V; Max Supply Voltage: 32V; Voltage Gain: 100dB; Common Mode Rejection Ratio: 65dB; Min Dual Supply Voltage: 1.5V; Max Dual Supply Voltage: 16V; Quiescent Current: 600mA; Supplier 1: Mouser; Manufacturer Part Number: LM358PWR; Stock 1: 6529; Pricing 1: 1=0.38, 10=0.284, 50=0.284, 100=0.154, 1000=0.116, 2000=0.1, 10000=0.093, 24000=0.086, 50000=0.082, 100000=0.079 (USD); Mount: Surface Mount; Case/Package: TSSOP; Number of Pins: 8; Min Operating Temperature: 0°C; Max Operating Temperature: 70°C; Packaging: Tape and Reel; Number of Circuits: 2; Output Current per Channel: 30mA; Package Quantity: 1; Bandwidth: 700kHz; Unity Gain Bandwidth Product: 700kHz; Number of Elements: 2; Operating Supply Voltage: 16V; Number of Amplifiers: 2; Radiation Hardening: No; Lead Free: Lead Free; REACH SVHC: No SVHC; ComponentLink1URL: http://www.ti.com/general/docs/suppproductinfo.tsp?distId=10&amp;gotoUrl=http%3A%2F%2Fwww.ti.com%2Flit%2Fgpn%2Flm358&src-supplier=Digi-Key; ComponentLink1Description: http://www.ti.com/general/docs/suppproductinfo.tsp?distId=10&amp;gotoUrl=http%3A%2F%2Fwww.ti.com%2Flit%2Fgpn%2Flm358&src-supplier=Digi-Key; ComponentLink2URL: http://www.ti.com/lit/ds/symlink/lm358.pdf?src-supplier=Digi-Key; ComponentLink2Description: http://www.ti.com/lit/ds/symlink/lm358.pdf?src-supplier=Digi-Key; ComponentLink3URL: http://www.produktinfo.conrad.com/datenblaetter/1000000-1099999/001072378-da-01-en-IC_OPAMP_GP_700KHZ_LM358PWR_TSSOP_8_TID.pdf?src-supplier=Conrad; ComponentLink3Description: http://www.produktinfo.conrad.com/datenblaetter/1000000-1099999/001072378-da-01-en-IC_OPAMP_GP_700KHZ_LM358PWR_TSSOP_8_TID.pdf?src-supplier=Conrad; Supplier Part Number 1: 595-LM358PWR
U4 = Regulator: Manufacturer: ON Semiconductor; Output Voltage: 3.3V; Max Input Voltage: 20V; Number of Outputs: 1; Dropout Voltage: 1.07V; Output Current: 1A; Max Supply Voltage: 15V; Min Supply Voltage: 4.75V; Min Input Voltage: 3.5V; Input Bias Current: 6mA; Quiescent Current: 10mA; Polarity: Positive; Reference Voltage: 1.25V; Accuracy: 1%; Output Type: Fixed; Supplier 1: Digi-Key; Supplier Part Number 1: NCP1117ST33T3GOSDKR-ND; Stock 1: 58869; Pricing 1: 1=0.52, 10=0.444, 100=0.3315, 500=0.26048, 1000=0.20129 (USD); Mount: Surface Mount; Case/Package: SOT-223; Number of Pins: 3; Contact Plating: Matte,Tin; Min Operating Temperature: 0°C; Max Operating Temperature: 125°C; Packaging: Tape and Reel; Max Output Current: 1A; Package Quantity: 1; Nominal Output Voltage: 3.3V; Number of Regulators: 1; Min Current Limit: 1A; Min Output Voltage: 3.3V; Max Output Voltage: 3.3V; Termination: SMD/SMT; Output Voltage Accuracy: 1%; Length: 6.7mm; Height: 1.69mm; Width: 3.7mm; Radiation Hardening: No; REACH SVHC: No SVHC; Lead Free: Lead Free; Halogen Free: Halogen Free
Y1 = XTAL: Crystal Oscillator; Manufacturer Part Number: ECS-160-20-3X-TR; Frequency Tolerance: 30ppm; Load Capacitance: 20pF; ESR (Equivalent Series Resistance): 50R; Frequency Stability: 50ppm; Manufacturer: *; PartNumber: *; Package Type: *; Supplier 1: Digi-Key; Supplier Part Number 1: XC1776DKR-ND; Stock 1: 30831; Pricing 1: 1=0.38, 10=0.316, 50=0.2846, 100=0.253, 500=0.24036, 1000=0.2024 (USD); Mount: Surface Mount; Min Operating Temperature: -10°C; Max Operating Temperature: 70°C; Package Quantity: 1; Frequency: 16MHz; Packaging: Tape and Reel; Tolerance: 30ppm; Termination: SMD/SMT; Length: 0.276inch; Height: 0.091inch; Width: 0.161inch; Lead Free: Lead Free